# EAGLE design domino-clock-r1-controller (EAGLE 5.11)
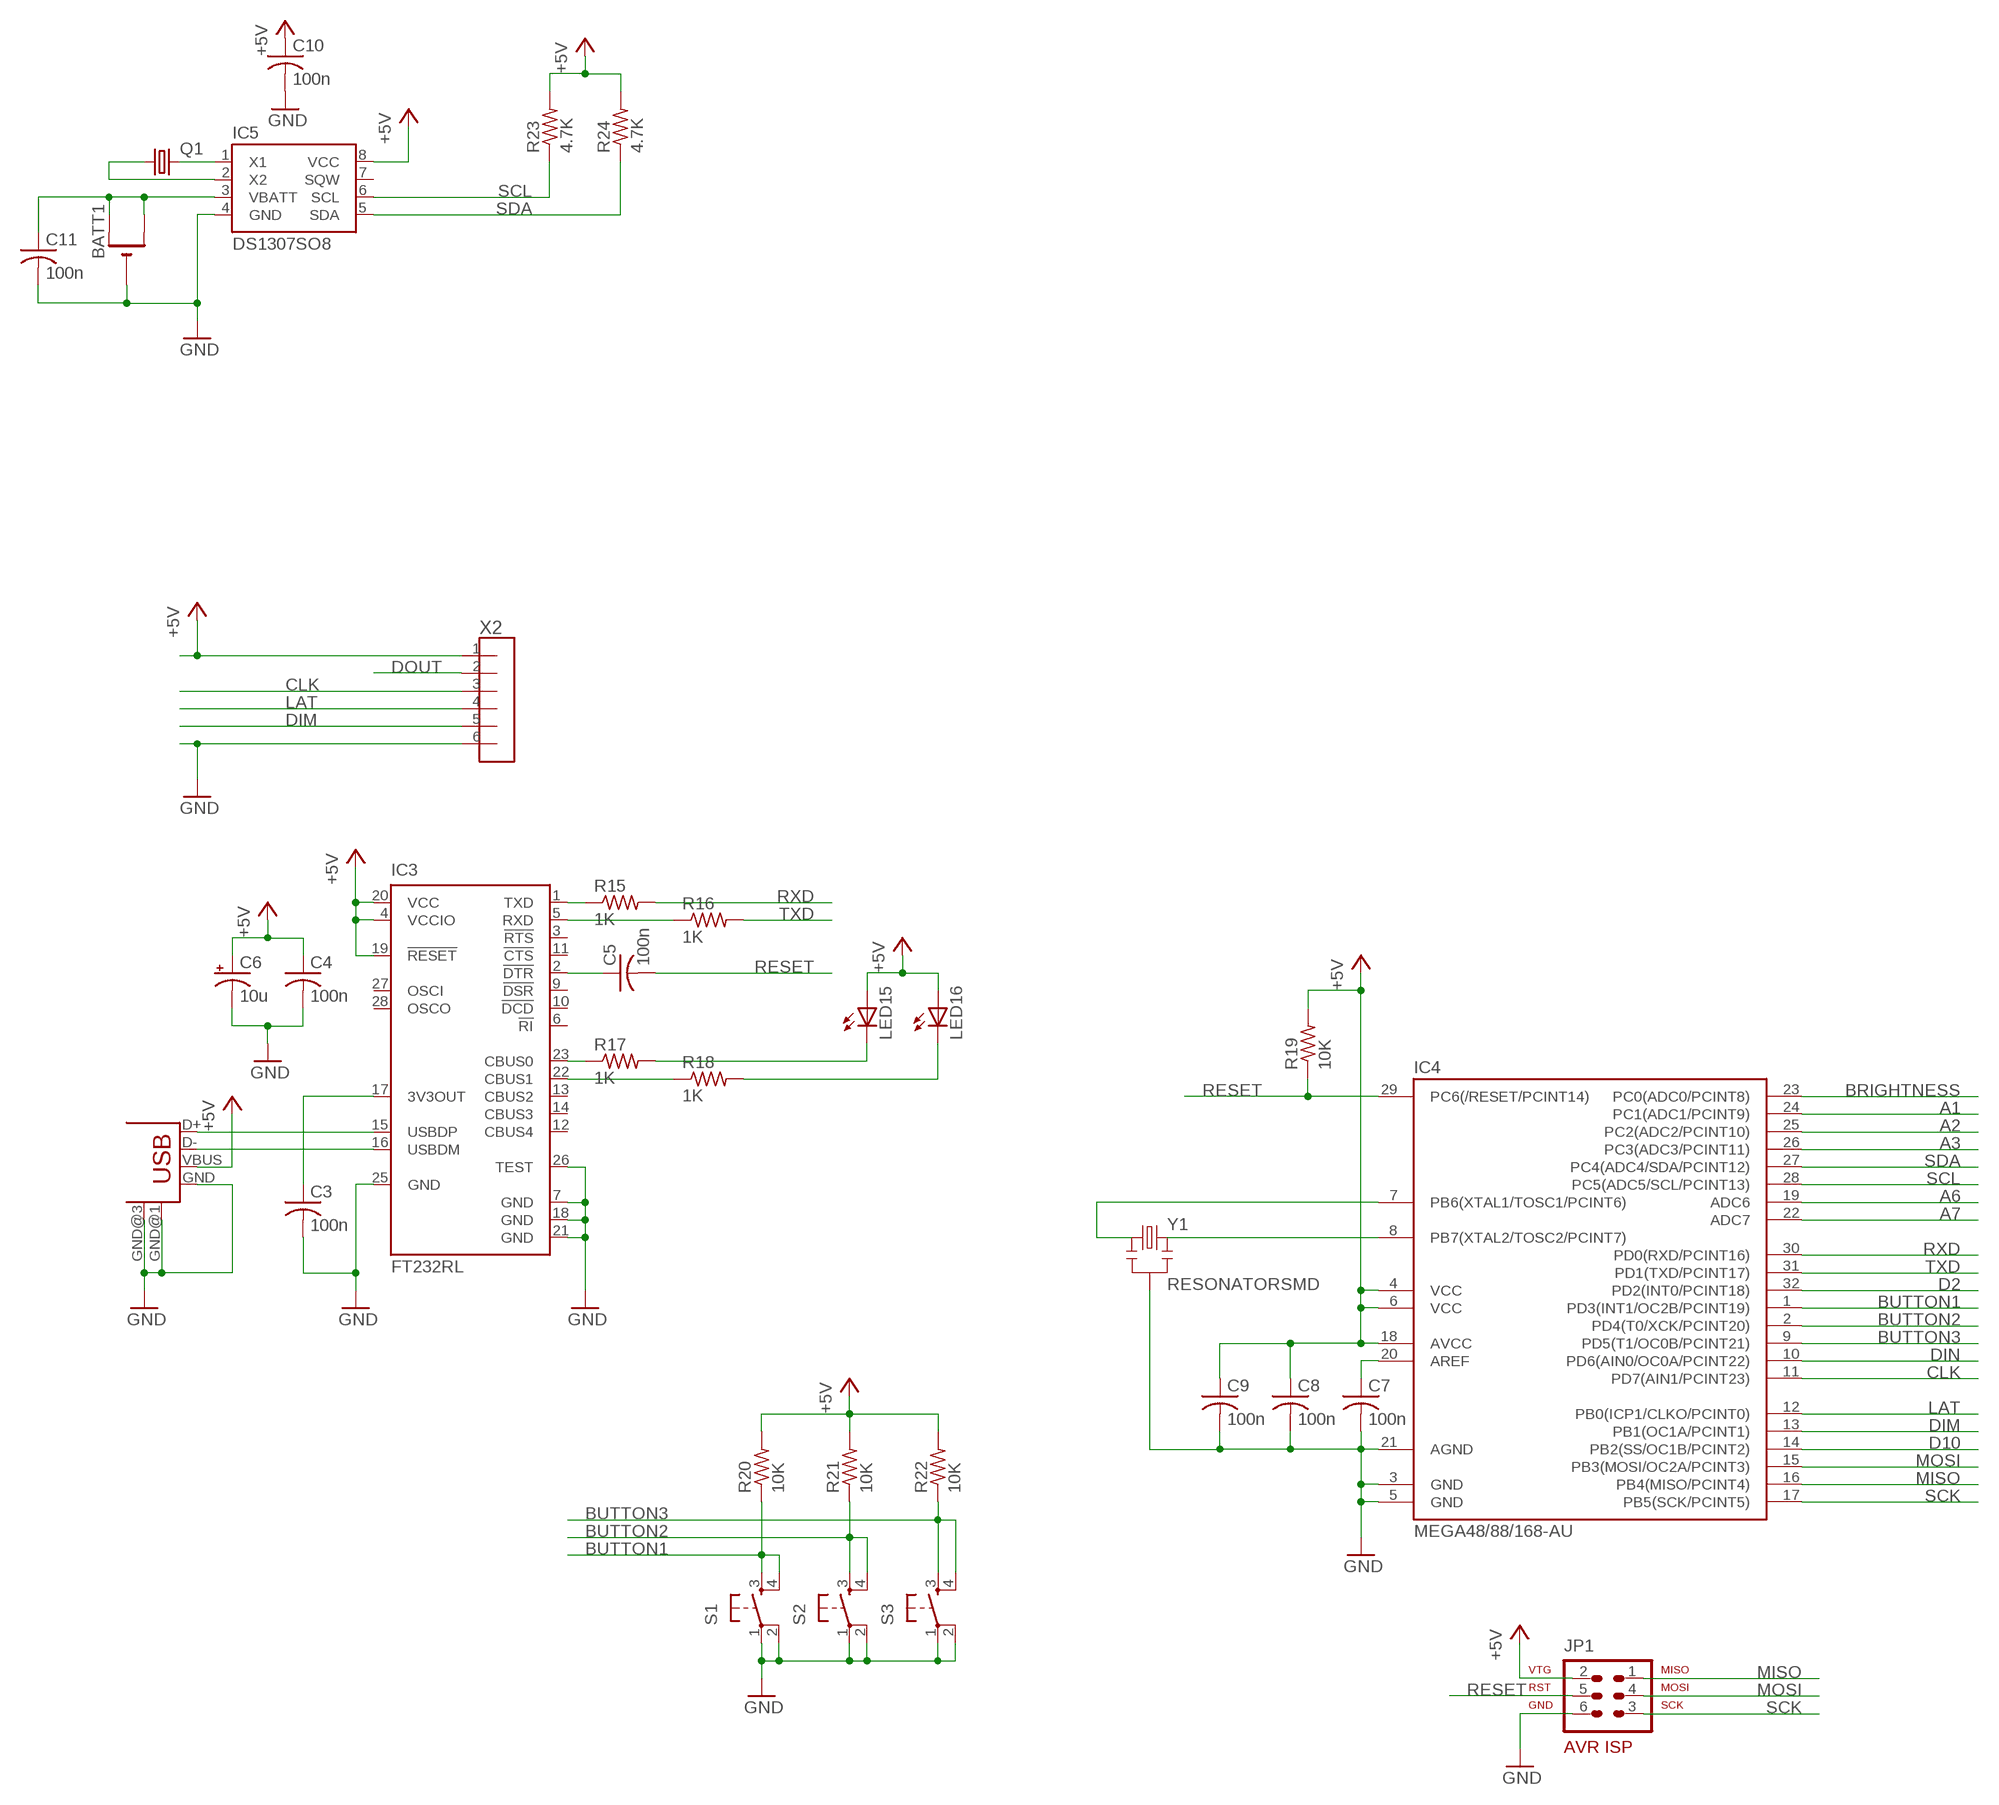
[diagram p0: schematic, sheet 1]

## Parts
BATT1  CR1220SMT  [CR1220-SMD]
C3  100n  C-USC0603  [C0603]
C4  100n  C-USC0603  [C0603]
C5  100n  C-USC0603  [C0603]
C6  10u  CPOL-USB  [PANASONIC_B]
C7  100n  C-USC0603  [C0603]
C8  100n  C-USC0603  [C0603]
C9  100n  C-USC0603  [C0603]
C10  100n  C-USC0603  [C0603]
C11  100n  C-USC0603  [C0603]
IC3  FT232RL  [SSOP28]
IC4  MEGA48/88/168-AU  [TQFP32-08]
IC5  DS1307SO8  [SO08]
JP1  AVR-ISP-6  [AVR-ISP-6]
LED15  LEDCHIP-LED0603  [CHIP-LED0603]
LED16  LEDCHIP-LED0603  [CHIP-LED0603]
Q1  CRYSTALTC38H  [TC38H]
R15  1K  R-US_R0603  [R0603]
R16  1K  R-US_R0603  [R0603]
R17  1K  R-US_R0603  [R0603]
R18  1K  R-US_R0603  [R0603]
R19  10K  R-US_R0603  [R0603]
R20  10K  R-US_R0603  [R0603]
R21  10K  R-US_R0603  [R0603]
R22  10K  R-US_R0603  [R0603]
R23  4.7K  R-US_R0603  [R0603]
R24  4.7K  R-US_R0603  [R0603]
S1  TAC_SWITCHSMD  [TACTILE_SWITCH_SMD]
S2  TAC_SWITCHSMD  [TACTILE_SWITCH_SMD]
S3  TAC_SWITCHSMD  [TACTILE_SWITCH_SMD]
USB1  USB-RAYMOND  [USB-MB-RAYMOND]
X2  M06-100MIL  [100MIL-6]
Y1  RESONATORSMD  [RESONATOR-SMD]

## Nets
+5V: C4.1 C6.+ C8.1 C9.1 C10.1 IC3.4(VCCIO) IC3.19(!RESET) IC3.20(VCC) IC4.4(VCC) IC4.6(VCC) IC4.18(AVCC) IC5.8(VCC) JP1.2 LED15.A LED16.A R19.2 R20.2 R21.2 R22.2 R23.2 R24.2 USB1.VBUS X2.1
A1: IC4.24(PC1(ADC1/PCINT9))
A2: IC4.25(PC2(ADC2/PCINT10))
A3: IC4.26(PC3(ADC3/PCINT11))
A6: IC4.19(ADC6)
A7: IC4.22(ADC7)
BRIGHTNESS: IC4.23(PC0(ADC0/PCINT8))
BUTTON1: IC4.1(PD3(INT1/OC2B/PCINT19)) R20.1 S1.3 S1.4
BUTTON2: IC4.2(PD4(T0/XCK/PCINT20)) R21.1 S2.3 S2.4
BUTTON3: IC4.9(PD5(T1/OC0B/PCINT21)) R22.1 S3.3 S3.4
CLK: IC4.11(PD7(AIN1/PCINT23)) X2.3
D2: IC4.32(PD2(INT0/PCINT18))
D10: IC4.14(PB2(SS/OC1B/PCINT2))
DIM: IC4.13(PB1(OC1A/PCINT1)) X2.5
DIN: IC4.10(PD6(AIN0/OC0A/PCINT22))
DOUT: X2.2
GND: BATT1.- C3.2 C4.2 C6.- C7.2 C8.2 C9.2 C10.2 C11.2 IC3.7(GND) IC3.18(GND) IC3.21(GND) IC3.25(GND) IC3.26(TEST) IC4.3(GND) IC4.5(GND) IC4.21(AGND) IC5.4(GND) JP1.6 S1.1 S1.2 S2.1 S2.2 S3.1 S3.2 USB1.GND USB1.GND@1(GND) USB1.GND@3(GND) X2.6 Y1.2
LAT: IC4.12(PB0(ICP1/CLKO/PCINT0)) X2.4
MISO: IC4.16(PB4(MISO/PCINT4)) JP1.1
MOSI: IC4.15(PB3(MOSI/OC2A/PCINT3)) JP1.4
N$30: IC3.15(USBDP) USB1.D+
N$31: IC3.16(USBDM) USB1.D-
N$32: IC3.23(CBUS0) R17.1
N$33: C3.1 IC3.17(3V3OUT)
N$34: IC3.22(CBUS1) R18.1
N$35: C5.1 IC3.2(!DTR)
N$36: IC3.1(TXD) R15.1
N$37: IC3.5(RXD) R16.1
N$38: LED15.C R17.2
N$39: LED16.C R18.2
N$40: IC4.7(PB6(XTAL1/TOSC1/PCINT6)) Y1.1
N$41: IC4.8(PB7(XTAL2/TOSC2/PCINT7)) Y1.3
N$42: C7.1 IC4.20(AREF)
N$43: IC5.2(X2) Q1.1
N$44: IC5.1(X1) Q1.2
N$46: BATT1.+$1(+) BATT1.+$2(+1) C11.1 IC5.3(VBATT)
RESET: C5.2 IC4.29(PC6(/RESET/PCINT14)) JP1.5 R19.1
RXD: IC4.30(PD0(RXD/PCINT16)) R15.2
SCK: IC4.17(PB5(SCK/PCINT5)) JP1.3
SCL: IC4.28(PC5(ADC5/SCL/PCINT13)) IC5.6(SCL) R23.1
SDA: IC4.27(PC4(ADC4/SDA/PCINT12)) IC5.5(SDA) R24.1
TXD: IC4.31(PD1(TXD/PCINT17)) R16.2
Unconnected: IC3.3(!RTS) IC3.6(!RI) IC3.9(!DSR) IC3.10(!DCD) IC3.11(!CTS) IC3.12(CBUS4) IC3.13(CBUS2) IC3.14(CBUS3) IC3.27(OSCI) IC3.28(OSCO) IC5.7(SQW)

## Library data of the parts
BATT1 = adafruit:CR1220: CR1216/CR1220/CR1225 12mm 3V lithium coin cell Great for battery packup. Both SMT and THM holders. Note the THM package has the ground pads on both sides of the PCB so that the masks are the same - this reduces the cost
C3-C5 C7-C11 = rcl:C-US: CAPACITOR, American symbol
C6 = rcl:CPOL-US: POLARIZED CAPACITOR, American symbol
IC3 = ftdichip:FT232R: Source: http://www.ftdichip.com/Documents/DataSheets/DS_FT232R_v104.pdf; MPN: FT232RL; OC_FARNELL: 1146032; OC_NEWARK: 91K9918
IC4 = avr-5:MEGA48/88/168
IC5 = SparkFun:DS1307
JP1 = avr-5:AVR-ISP-6: AVR ISP-6 Serial Programming Header
LED15 LED16 = led:LED: LED OSRAM: - CHIPLED LG R971, LG N971, LY N971, LG Q971, LY Q971, LO R971, LY R971 LH N974, LH R974 LS Q976, LO Q976, LY Q976 LO Q996 - Hyper CHIPLED LW Q18S LB Q993, LB Q99A, LB R99A - SideLED LS A670, LO A670, LY A670, LG A670, LP A670 LB A673, LV A673, LT A673, LW A673 LH A674 LY A675 LS A676, LA A676, LO A676, LY A676, LW A676 LS A679, LY A679, LG A679 - Hyper Micro SIDELED® LS Y876, LA Y876, LO Y876, LY Y876 LT Y87S - SmartLED LW L88C, LW L88S LB L89C, LB L89S, LG L890 LS L89K, LO L89K, LY L89K LS L896, LA L896, LO L896, LY L896 - TOPLED LS T670, LO T670, LY T670, LG T670, LP T670 LSG T670, LSP T670, LSY T670, LOP T670, LYG T670 LG T671, LOG T671, LSG T671 LB T673, LV T673, LT T673, LW T673 LH T674 LS T676, LA T676, LO T676, LY T676, LB T676, LH T676, LSB T676, LW T676 LB T67C, LV T67C, LT T67C, LS T67K, LO T67K, LY T67K, LW E67C LS E67B, LA E67B, LO E67B, LY E67B, LB E67C, LV E67C, LT E67C LW T67C LS T679, LY T679, LG T679 LS T770, LO T770, LY T770, LG T770, LP T770 LB T773, LV T773, LT T773, LW T773 LH T774 LS E675, LA E675, LY E675, LS T675 LS T776, LA T776, LO T776, LY T776, LB T776 LHGB T686 LT T68C, LB T68C - Hyper Mini TOPLED® LB M676 - Mini TOPLED Santana® LG M470 LS M47K, LO M47K, LY M47K Source: http://www.osram.convergy.de LUXEON: - LUMILED® LXK2-PW12-R00, LXK2-PW12-S00, LXK2-PW14-U00, LXK2-PW14-V00 LXK2-PM12-R00, LXK2-PM12-S00, LXK2-PM14-U00 LXK2-PE12-Q00, LXK2-PE12-R00, LXK2-PE12-S00, LXK2-PE14-T00, LXK2-PE14-U00 LXK2-PB12-K00, LXK2-PB12-L00, LXK2-PB12-M00, LXK2-PB14-N00, LXK2-PB14-P00, LXK2-PB14-Q00 LXK2-PR12-L00, LXK2-PR12-M00, LXK2-PR14-Q00, LXK2-PR14-R00 LXK2-PD12-Q00, LXK2-PD12-R00, LXK2-PD12-S00 LXK2-PH12-R00, LXK2-PH12-S00 LXK2-PL12-P00, LXK2-PL12-Q00, LXK2-PL12-R00 Source: www.luxeon.com KINGBRIGHT: KA-3528ASYC Source: www.kingbright.com
Q1 = crystal:CRYSTAL: CRYSTAL; OC_FARNELL: unknown; OC_NEWARK: unknown
R15-R24 = rcl:R-US_: RESISTOR, American symbol
S1-S3 = SparkFun:TAC_SWITCH: Momentary Switch Button commonly used for reset or general input. Spark Fun Electronics SKU : COM-00097
USB1 = con-usb-2:USB: USB Connectors
X2 = rbg-generic-headers:M06-100MIL
Y1 = SparkFun:RESONATOR: Resonator Small SMD resonator. This is the itty bitty 10/20MHz resonators with built in caps. CSTCE10M0G55 and CSTCE20M0V53. Footprint has been reviewed closely but hasn't been tested yet.

## Board
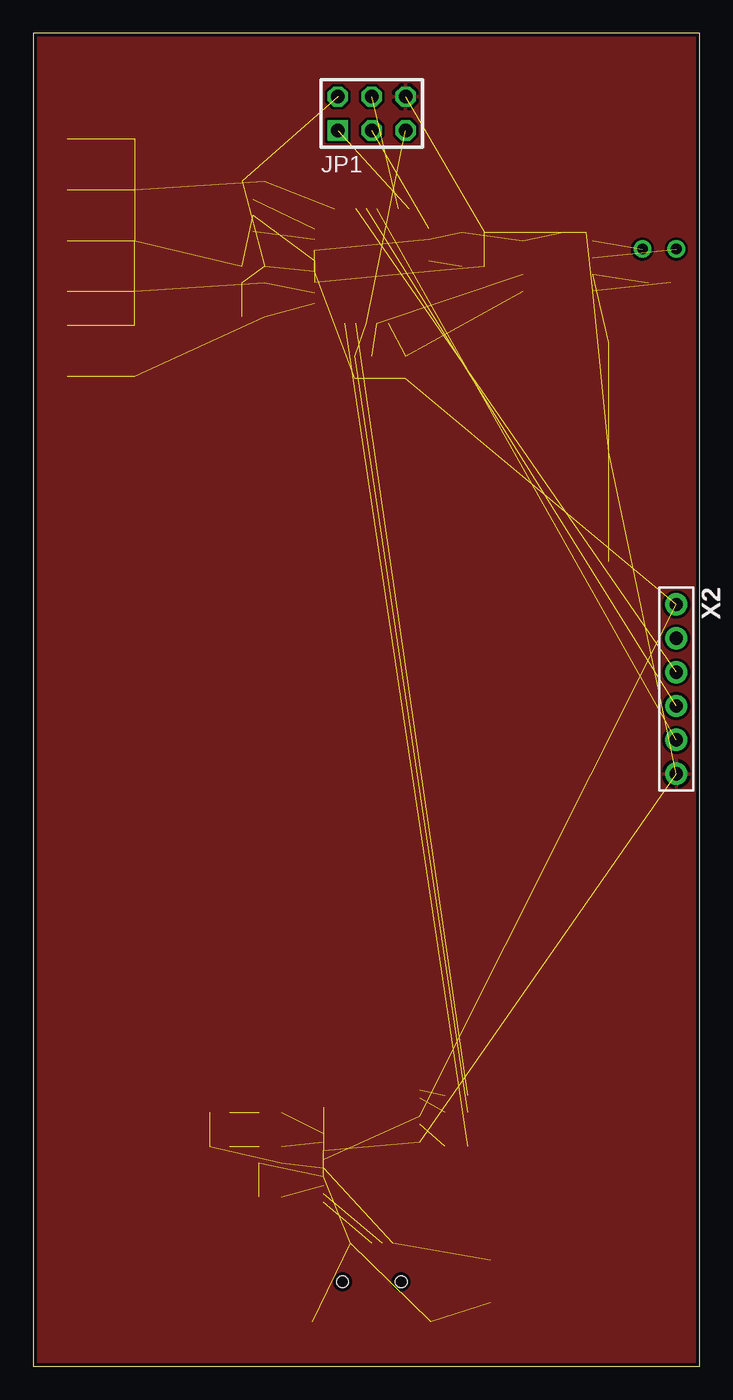
[diagram p1: board, top side]
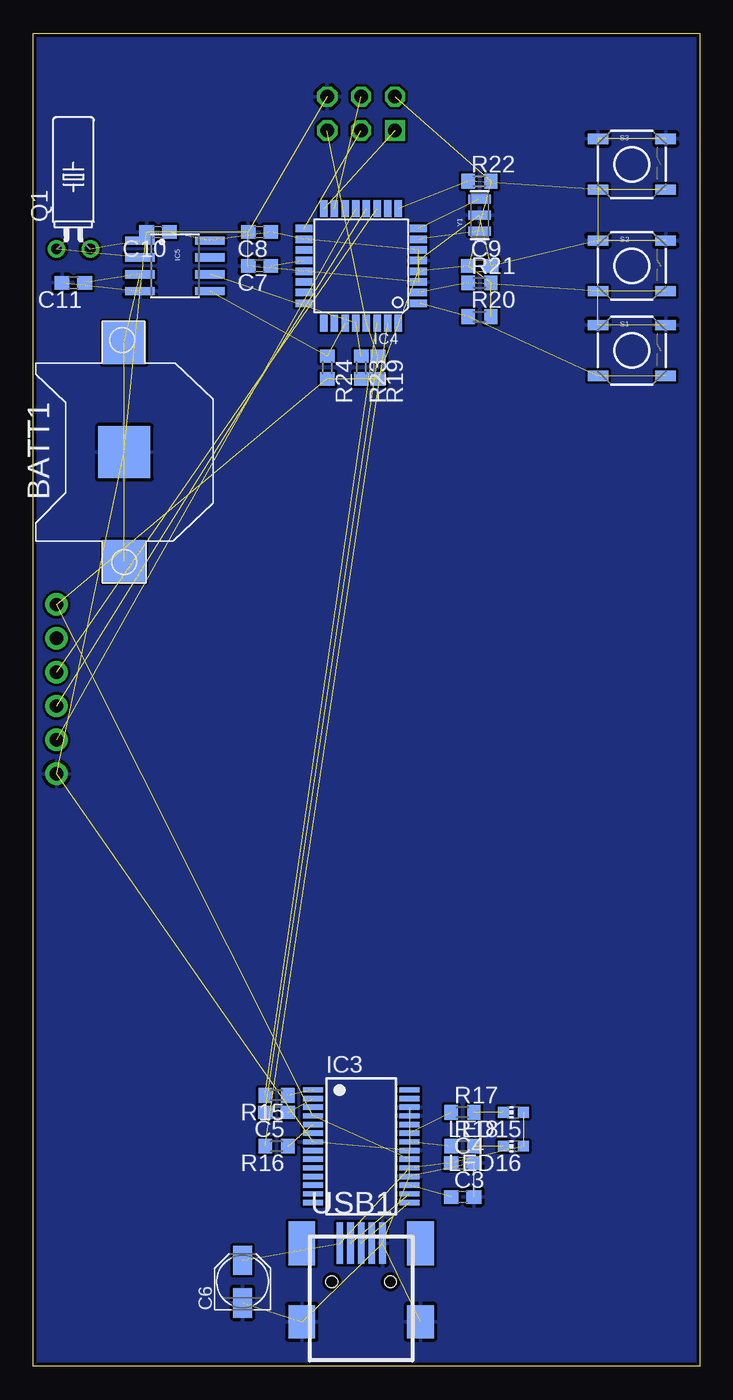
[diagram p2: board, bottom side, seen from below]

Size 50 x 100 mm. Coordinates in mm from the lower left corner, seen from the top.
Outline: 0,0 50,0 50,100 0,100 0,0
Copper layers (1*16): Top 0.035mm / dielectric 1.5mm / Bottom 0.035mm
Design rules "default *": minimum track width 8mil, minimum drill 12mil, track to track 8mil, track to pad 8mil, pad to pad 8mil, via to via 8mil, smd to smd 8mil, copper to edge 10mil, drill to drill 8mil, minimum pad ring 10mil, minimum via ring 8mil, stop-mask expansion 4mil, vias tented up to drill 18mil, thermal gap 10mil

### Footprints (pad centres in the part's own frame; a part is rotated, then mirrored left to right if it is on the bottom)
CR1220-SMD = smd 3.2 x 3.2: +$1 -8.2,0; +$2 8.2,0 | smd 3.9 x 3.9: - 0,0
C0603 = smd 1.1 x 1: 1 -0.85,0; 2 0.85,0
PANASONIC_B = smd 2.2 x 1.4: + 1.6,0; - -1.6,0
SSOP28 = smd 0.4 x 1.5: 1 -4.225,-3.625; 2 -3.575,-3.625; 3 -2.925,-3.625; 4 -2.275,-3.625; 5 -1.625,-3.625; 6 -0.975,-3.625; 7 -0.325,-3.625; 8 0.325,-3.625; 9 0.975,-3.625; 10 1.625,-3.625; 11 2.275,-3.625; 12 2.925,-3.625; 13 3.575,-3.625; 14 4.225,-3.625; 15 4.225,3.625; 16 3.575,3.625; 17 2.925,3.625; 18 2.275,3.625; 19 1.625,3.625; 20 0.975,3.625; 21 0.325,3.625; 22 -0.325,3.625; 23 -0.975,3.625; 24 -1.625,3.625; 25 -2.275,3.625; 26 -2.925,3.625; 27 -3.575,3.625; 28 -4.225,3.625
TQFP32-08 = smd 1.27 x 0.559: 1 -4.293,2.8; 2 -4.293,2; 3 -4.293,1.2; 4 -4.293,0.4; 5 -4.293,-0.4; 6 -4.293,-1.2; 7 -4.293,-2; 8 -4.293,-2.8; 17 4.293,-2.8; 18 4.293,-2; 19 4.293,-1.2; 20 4.293,-0.4; 21 4.293,0.4; 22 4.293,1.2; 23 4.293,2; 24 4.293,2.8 | smd 0.559 x 1.27: 9 -2.8,-4.293; 10 -2,-4.293; 11 -1.2,-4.293; 12 -0.4,-4.293; 13 0.4,-4.293; 14 1.2,-4.293; 15 2,-4.293; 16 2.8,-4.293; 25 2.8,4.293; 26 2,4.293; 27 1.2,4.293; 28 0.4,4.293; 29 -0.4,4.293; 30 -1.2,4.293; 31 -2,4.293; 32 -2.8,4.293
SO08 = smd 0.61 x 2.21: 1 -1.905,-2.616; 2 -0.635,-2.616; 3 0.635,-2.616; 4 1.905,-2.616; 5 1.905,2.616; 6 0.635,2.616; 7 -0.635,2.616; 8 -1.905,2.616
AVR-ISP-6 = drill 1.016 square: 1 -2.54,-1.27 | drill 1.016 octagon: 2 -2.54,1.27; 3 0,-1.27; 4 0,1.27; 5 2.54,-1.27; 6 2.54,1.27
CHIP-LED0603 = smd 0.8 x 0.8: A 0,-0.75; C 0,0.75
TC38H = drill 0.813 round: 1 -1.27,0; 2 1.27,0
R0603 = smd 1 x 1.1: 1 -0.85,0; 2 0.85,0
TACTILE_SWITCH_SMD = smd 1.524 x 0.762: 1 -2.54,1.905; 2 2.54,1.905; 3 -2.54,-1.905; 4 2.54,-1.905
USB-MB-RAYMOND = smd 0.5 x 3.1: D+ 0,4.15; D- -0.8,4.15; GND 1.6,4.15; ID 0.8,4.15; VBUS -1.6,4.15 | smd 2 x 2.5: GND@1 -4.45,-1.75; GND@3 4.45,-1.75 | smd 2 x 3.3: GND@2 -4.45,4.15; GND@4 4.45,4.15 | hole 0.9: -2.2,1.25; 2.2,1.25
100MIL-6 = drill 1 pad 1.676 round: 1 -6.35,0; 2 -3.81,0; 3 -1.27,0; 4 1.27,0; 5 3.81,0; 6 6.35,0
RESONATOR-SMD = smd 0.7 x 1.7: 1 -1.2,0; 2 0,0; 3 1.2,0

### Placement (x,y rotation side)
BATT1  43.18,68.58 90 bottom
C3  17.78,12.7 0 bottom
C4  17.78,15.24 0 bottom
C5  31.75,19.05 180 bottom
C6  34.29,6.35 90 bottom
C7  33.02,82.55 180 bottom
C8  33.02,85.09 180 bottom
C9  16.51,82.55 0 bottom
C10  40.64,85.09 180 bottom
C11  46.99,81.28 180 bottom
IC3  25.4,16.51 270 bottom
IC4  25.4,82.55 180 bottom
IC5  39.37,82.55 270 bottom
JP1  25.4,93.98 0 top
LED15  13.97,19.05 90 bottom
LED16  13.97,16.51 90 bottom
Q1  46.99,83.82 0 bottom
R15  31.75,20.32 180 bottom
R16  31.75,16.51 180 bottom
R17  17.78,19.05 0 bottom
R18  17.78,16.51 0 bottom
R19  24.13,74.93 270 bottom
R20  16.51,78.74 0 bottom
R21  16.51,81.28 0 bottom
R22  16.51,88.9 0 bottom
R23  25.4,74.93 270 bottom
R24  27.94,74.93 270 bottom
S1  5.08,76.2 0 bottom
S2  5.08,82.55 0 bottom
S3  5.08,90.17 0 bottom
USB1  25.4,5.08 0 bottom
X2  48.26,50.8 270 top
Y1  16.51,86.36 90 bottom

### Tracks (layer width: path | path; a pad name or v marks a point on that pad's centre or on a via)
+5V  (22 unrouted)
BUTTON1  (3 unrouted)
BUTTON2  (3 unrouted)
BUTTON3  (3 unrouted)
CLK  (1 unrouted)
DIM  (1 unrouted)
GND  (29 unrouted)
  pour Top: -1,-1 51,-1 51,101 -1,101
  pour Bottom: -1,-1 51,-1 51,101 -1,101
LAT  (1 unrouted)
MISO  (1 unrouted)
MOSI  (1 unrouted)
N$30  (1 unrouted)
N$31  (1 unrouted)
N$32  (1 unrouted)
N$33  (1 unrouted)
N$34  (1 unrouted)
N$35  (1 unrouted)
N$36  (1 unrouted)
N$37  (1 unrouted)
N$38  (1 unrouted)
N$39  (1 unrouted)
N$40  (1 unrouted)
N$41  (1 unrouted)
N$42  (1 unrouted)
N$43  (1 unrouted)
N$44  (1 unrouted)
N$46  (3 unrouted)
RESET  (3 unrouted)
RXD  (1 unrouted)
SCK  (1 unrouted)
SCL  (2 unrouted)
SDA  (2 unrouted)
TXD  (1 unrouted)